# EAGLE schematic Z80_Sound_2 (EAGLE 5.10)
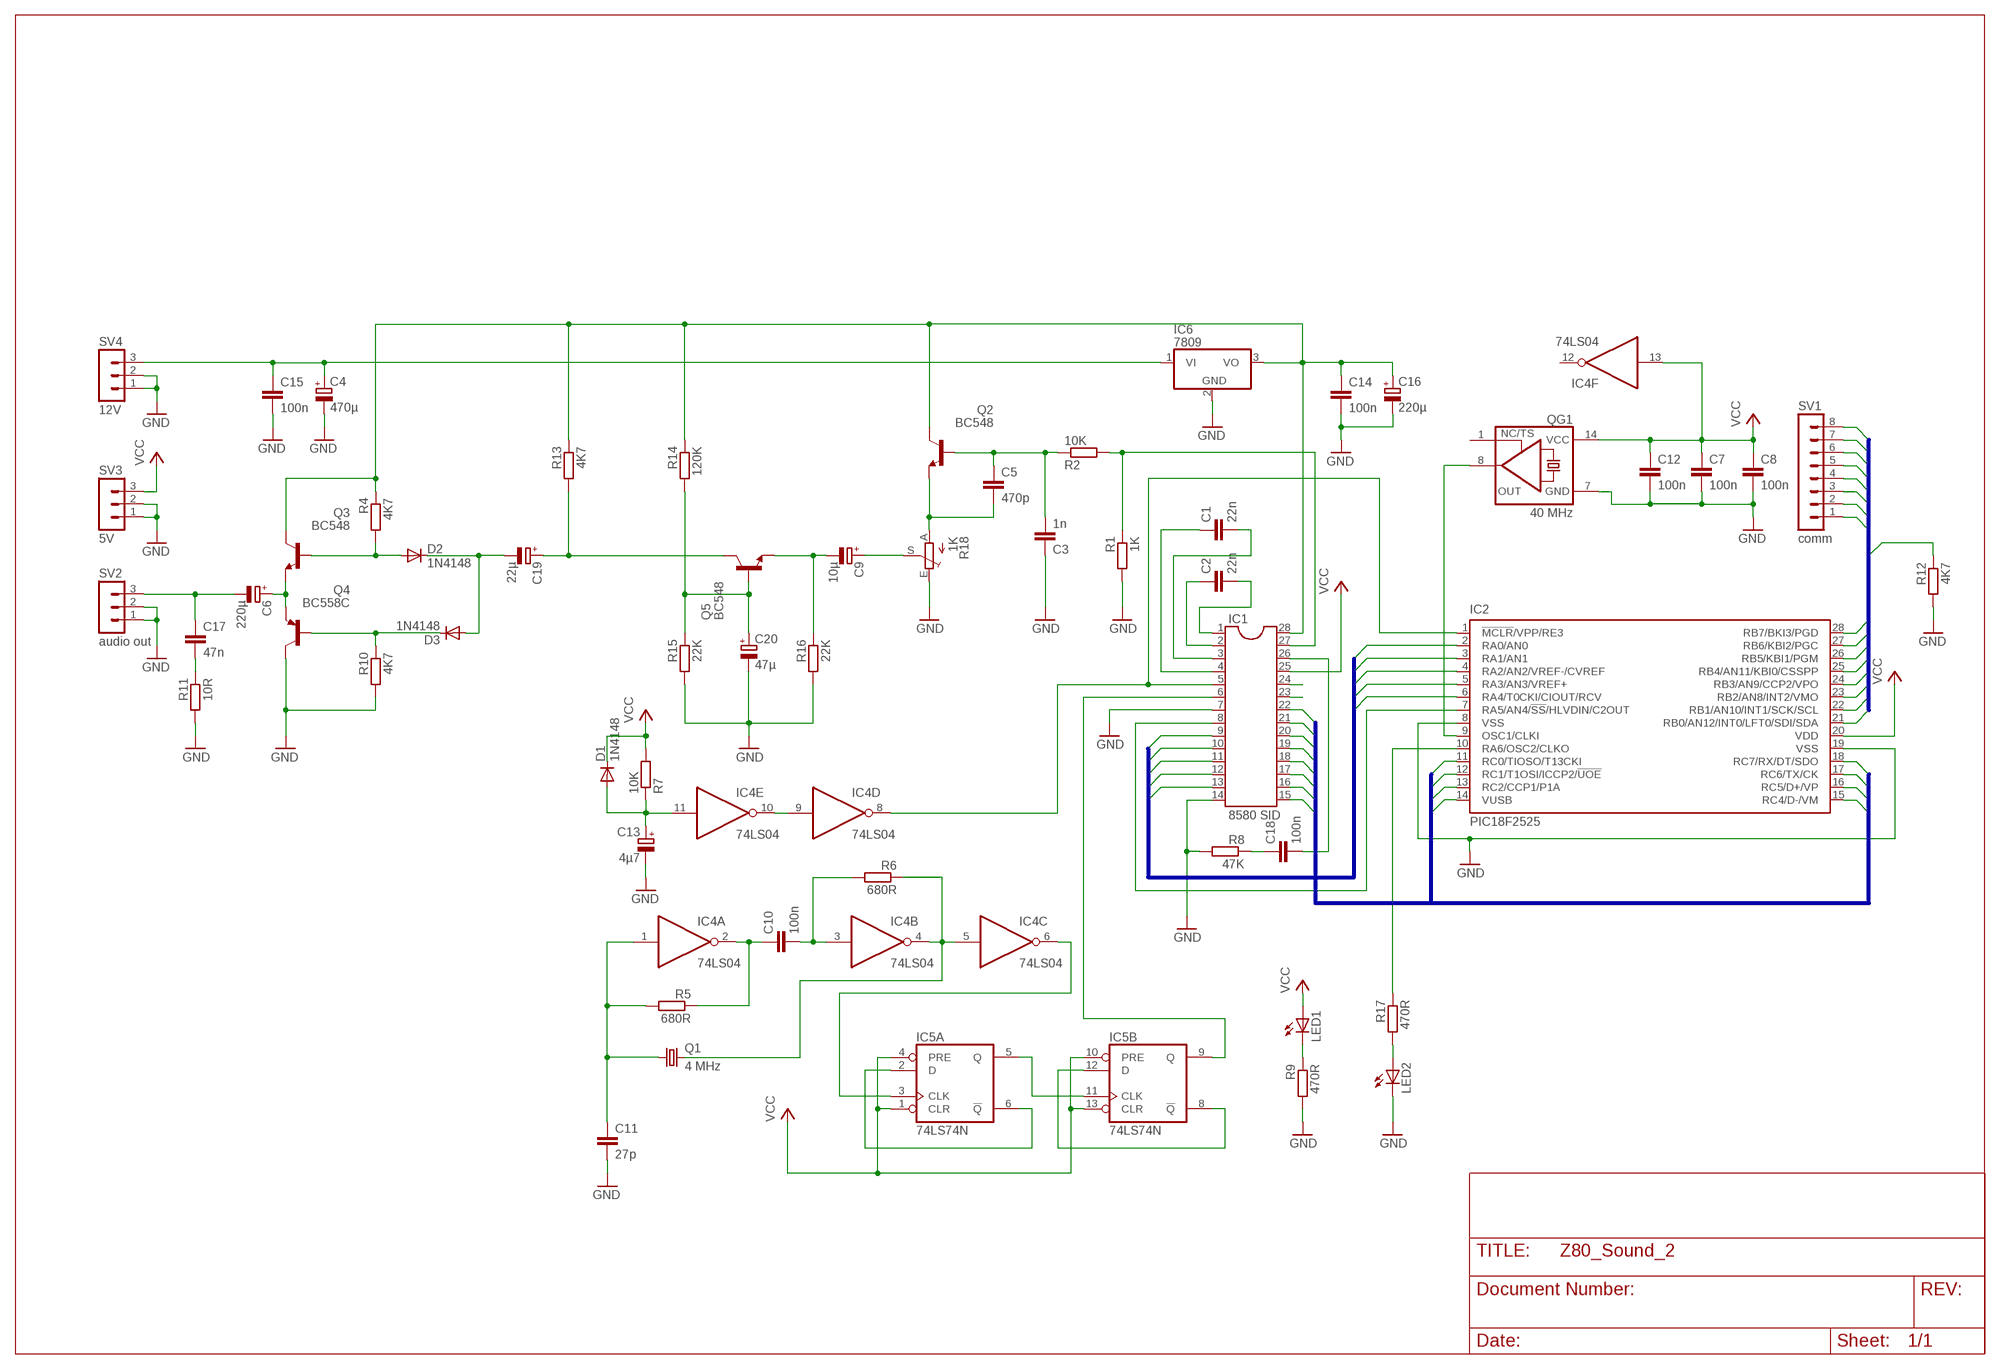
[diagram p0: schematic, sheet 1]

## Parts
C1  22n  C-EU050-035X075  [C050-035X075]
C2  22n  C-EU050-035X075  [C050-035X075]
C3  1n  C-EU050-035X075  [C050-035X075]
C4  470µ  CPOL-EUE3.5-10  [E3,5-10]
C5  470p  C-EU025-024X044  [C025-024X044]
C6  220µ  CPOL-EUE3.5-8  [E3,5-8]
C7  100n  C-EU050-030X075  [C050-030X075]
C8  100n  C-EU050-030X075  [C050-030X075]
C9  10µ  CPOL-EUE3.5-8  [E3,5-8]
C10  100n  C-EU050-030X075  [C050-030X075]
C11  27p  C-EU025-024X044  [C025-024X044]
C12  100n  C-EU050-030X075  [C050-030X075]
C13  4µ7  CPOL-EUE3.5-8  [E3,5-8]
C14  100n  C-EU050-030X075  [C050-030X075]
C15  100n  C-EU050-030X075  [C050-030X075]
C16  220µ  CPOL-EUE3.5-8  [E3,5-8]
C17  47n  C-EU050-024X044  [C050-024X044]
C18  100n  C-EU050-030X075  [C050-030X075]
C19  22µ  CPOL-EUE3.5-8  [E3,5-8]
C20  47µ  CPOL-EUE3.5-8  [E3,5-8]
D1  1N4148  1N4148DO35-7  [DO35-7]
D2  1N4148  1N4148DO35-7  [DO35-7]
D3  1N4148  1N4148DO35-7  [DO35-7]
IC1  8580 SID  DIL28  [DIL28-6]
IC2  PIC18F2525  PIC18F2455_28DIP  [DIL28-3]
IC4  74LS04  74LS04N  [DIL14]
IC5  74LS74N  [DIL14]
IC6  7809  786TV  [TO220V]
LED1  LED5MM  [LED5MM]
LED2  LED5MM  [LED5MM]
Q1  4 MHz  CRYSTALHC49S  [HC49/S]
Q2  BC548  [TO92-EBC]
Q3  BC548  [TO92-EBC]
Q4  BC558C  [TO92-EBC]
Q5  BC548  [TO92-EBC]
QG1  40 MHz  XO-14  [DIL14S]
R1  1K  R-EU_0207/10  [0207/10]
R2  10K  R-EU_0207/10  [0207/10]
R4  4K7  R-EU_0207/10  [0207/10]
R5  680R  R-EU_0207/10  [0207/10]
R6  680R  R-EU_0207/10  [0207/10]
R7  10K  R-EU_0207/10  [0207/10]
R8  47K  R-EU_0207/10  [0207/10]
R9  470R  R-EU_0207/10  [0207/10]
R10  4K7  R-EU_0207/10  [0207/10]
R11  10R  R-EU_0207/10  [0207/10]
R12  4K7  R-EU_0207/10  [0207/10]
R13  4K7  R-EU_0207/10  [0207/10]
R14  120K  R-EU_0207/10  [0207/10]
R15  22K  R-EU_0207/10  [0207/10]
R16  22K  R-EU_0207/2V  [0207/2V]
R17  470R  R-EU_0207/10  [0207/10]
R18  1K  TRIM_EU-LI15  [LI15]
SV1  comm  MA08-1  [MA08-1]
SV2  audio out  MA03-1  [MA03-1]
SV3  5V  MA03-1  [MA03-1]
SV4  12V  MA03-1  [MA03-1]

## Nets
+12V: C4.+ C15.1 IC6.1(VI) SV4.3
/CS: IC1.8 IC2.7(RA5/AN4/!SS!/HLVDIN/C2OUT)
/RES: IC1.5 IC2.1(!MCLR!/VPP/RE3) IC4.8(D:O)
A0: IC1.9 IC2.2(RA0/AN0)
A1: IC1.10 IC2.3(RA1/AN1)
A2: IC1.11 IC2.4(RA2/AN2/VREF-/CVREF)
A3: IC1.12 IC2.5(RA3/AN3/VREF+)
A4: IC1.13 IC2.6(RA4/T0CKI/CIOUT/RCV)
AUDIO_OUT: IC1.27 R1.1 R2.2
CAP1A: C2.2 IC1.1
CAP1B: C2.1 IC1.2
CAP2A: C1.2 IC1.3
CAP2B: C1.1 IC1.4
CLK_1MHZ: IC1.6 IC5.9(B:Q)
D0: IC1.15 IC2.11(RC0/TIOSO/T13CKI)
D1: IC1.16 IC2.12(RC1/T1OSI/ICCP2/!UOE)
D2: IC1.17 IC2.13(RC2/CCP1/P1A)
D3: IC1.18 IC2.14(VUSB)
D4: IC1.19 IC2.15(RC4/D-/VM)
D5: IC1.20 IC2.16(RC5/D+/VP)
D6: IC1.21 IC2.17(RC6/TX/CK)
D7: IC1.22 IC2.18(RC7/RX/DT/SDO)
GND: C3.1 C4.- C7.2 C8.2 C11.2 C12.2 C13.- C14.2 C15.2 C16.- C20.- IC1.7 IC1.14 IC2.8(VSS) IC2.19(VSS) IC6.2(GND) LED2.K(C) Q4.C QG1.7(GND) R1.2 R8.2 R9.2 R10.2 R11.2 R12.2 R15.2 R16.2 R18.E SV2.1 SV2.2 SV3.1 SV3.2 SV4.1 SV4.2
N$1: IC2.9(OSC1/CLKI) QG1.8(OUT)
N$2: IC4.4(B:O) IC4.5(C:I) Q1.2 R6.1
N$3: C5.2 Q2.E R18.A
N$4: LED1.K(C) R9.1
N$5: C6.- C17.1 SV2.3
N$6: C3.2 C5.1 Q2.B R2.1
N$7: LED2.A R17.2
N$8: C17.2 R11.1
N$9: D3.C Q4.B R10.1
N$10: D2.A Q3.B R4.2
N$11: C11.1 IC4.1(A:I) Q1.1 R5.2
N$12: IC5.2(A:D) IC5.6(A:!Q)
N$13: IC5.8(B:!Q) IC5.12(B:D)
N$14: IC4.6(C:O) IC5.3(A:CLK)
N$15: IC5.5(A:Q) IC5.11(B:CLK)
N$16: IC4.9(D:I) IC4.10(E:O)
N$17: C13.+ D1.A IC4.11(E:I) R7.1
N$18: C10.1 IC4.2(A:O) R5.1
N$19: C10.2 IC4.3(B:I) R6.2
N$20: C18.2 IC1.26
N$21: C6.+ Q3.E Q4.E
N$22: C19.- D2.C D3.A
N$23: C18.1 R8.1
N$24: IC2.10(RA6/OSC2/CLKO) R17.1
N$25: C19.+ Q5.C R13.2
N$26: C9.- Q5.E R16.1
N$27: C20.+ Q5.B R14.2 R15.1
N$30: C9.+ R18.S
POTX: IC1.24
POTY: IC1.23
RB0: IC2.21(RB0/AN12/INT0/LFT0/SDI/SDA) SV1.1
RB1: IC2.22(RB1/AN10/INT1/SCK/SCL) SV1.2
RB2: IC2.23(RB2/AN8/INT2/VMO) SV1.3
RB3: IC2.24(RB3/AN9/CCP2/VPO) SV1.4
RB4: IC2.25(RB4/AN11/KBI0/CSSPP) SV1.5
RB5: IC2.26(RB5/KBI1/PGM) SV1.6
RB6: IC2.27(RB6/KBI2/PGC) SV1.7
RB7: IC2.28(RB7/BKI3/PGD) R12.1 SV1.8
VCC: C7.1 C8.1 C12.1 D1.C IC1.25 IC2.20(VDD) IC4.13(F:I) IC5.1(A:CLR) IC5.4(A:PRE) IC5.10(B:PRE) IC5.13(B:CLR) LED1.A QG1.14(VCC) R7.2 SV3.3
VDD: C14.1 C16.+ IC1.28 IC6.3(VO) Q2.C Q3.C R4.1 R13.1 R14.1
Unconnected: IC4.12(F:O) QG1.1(TS)

## Buses
D[0..7]
RB[0..7]
A[0..4]

## Power pins joined to a net without a drawn wire
GND: IC4.7(P:GND) IC5.7(P:GND)
VCC: IC4.14(P:VCC) IC5.14(P:VCC)

## Library data of the parts
C1-C3 C5 C7 C8 C10-C12 C14 C15 C17 C18 = rcl:C-EU: CAPACITOR, European symbol
C4 C6 C9 C13 C16 C19 C20 = rcl:CPOL-EU: POLARIZED CAPACITOR, European symbol
D1-D3 = diode:1N4148: DIODE high speed (Philips)
IC1 = ic-package:DIL28: Dual In Line
IC2 = microchip:PIC18F2*_28: USB Microcontrollers with nanoWatt Technology High-Performance, Enhanced Flash, 28/40/44-Pin, Source: http://ww1.microchip.com/downloads/en/devicedoc/39632c.pdf
IC4 = 74xx-us:74*04: Hex INVERTER
IC5 = 74xx-us:74*74: Dual D type positive edge triggered FLIP FLOP, preset and clear
IC6 = linear:78*: Positive VOLTAGE REGULATOR Source: http://cache.national.com/ds/LM/LM78L05.pdf http://www.fairchildsemi.com/ds/LM/LM7805.pdf
LED1 LED2 = led:LED: LED OSRAM: - CHIPLED LG R971, LG N971, LY N971, LG Q971, LY Q971, LO R971, LY R971 LH N974, LH R974 LS Q976, LO Q976, LY Q976 LO Q996 - Hyper CHIPLED LW Q18S LB Q993, LB Q99A, LB R99A - SideLED LS A670, LO A670, LY A670, LG A670, LP A670 LB A673, LV A673, LT A673, LW A673 LH A674 LY A675 LS A676, LA A676, LO A676, LY A676, LW A676 LS A679, LY A679, LG A679 - Hyper Micro SIDELED® LS Y876, LA Y876, LO Y876, LY Y876 LT Y87S - SmartLED LW L88C, LW L88S LB L89C, LB L89S, LG L890 LS L89K, LO L89K, LY L89K LS L896, LA L896, LO L896, LY L896 - TOPLED LS T670, LO T670, LY T670, LG T670, LP T670 LSG T670, LSP T670, LSY T670, LOP T670, LYG T670 LG T671, LOG T671, LSG T671 LB T673, LV T673, LT T673, LW T673 LH T674 LS T676, LA T676, LO T676, LY T676, LB T676, LH T676, LSB T676, LW T676 LB T67C, LV T67C, LT T67C, LS T67K, LO T67K, LY T67K, LW E67C LS E67B, LA E67B, LO E67B, LY E67B, LB E67C, LV E67C, LT E67C LW T67C LS T679, LY T679, LG T679 LS T770, LO T770, LY T770, LG T770, LP T770 LB T773, LV T773, LT T773, LW T773 LH T774 LS E675, LA E675, LY E675, LS T675 LS T776, LA T776, LO T776, LY T776, LB T776 LHGB T686 LT T68C, LB T68C - Hyper Mini TOPLED® LB M676 - Mini TOPLED Santana® LG M470 LS M47K, LO M47K, LY M47K Source: http://www.osram.convergy.de LUXEON: - LUMILED® LXK2-PW12-R00, LXK2-PW12-S00, LXK2-PW14-U00, LXK2-PW14-V00 LXK2-PM12-R00, LXK2-PM12-S00, LXK2-PM14-U00 LXK2-PE12-Q00, LXK2-PE12-R00, LXK2-PE12-S00, LXK2-PE14-T00, LXK2-PE14-U00 LXK2-PB12-K00, LXK2-PB12-L00, LXK2-PB12-M00, LXK2-PB14-N00, LXK2-PB14-P00, LXK2-PB14-Q00 LXK2-PR12-L00, LXK2-PR12-M00, LXK2-PR14-Q00, LXK2-PR14-R00 LXK2-PD12-Q00, LXK2-PD12-R00, LXK2-PD12-S00 LXK2-PH12-R00, LXK2-PH12-S00 LXK2-PL12-P00, LXK2-PL12-Q00, LXK2-PL12-R00 Source: www.luxeon.com KINGBRIGHT: KA-3528ASYC Source: www.kingbright.com
Q1 = crystal:CRYSTAL: CRYSTAL
Q2 Q3 Q5 = transistor-npn:BC548*: NPN Transistor
Q4 = transistor-pnp:BC558*: PNP Transistror
QG1 = crystal:XO-: CRYSTAL
R1 R2 R4-R17 = rcl:R-EU_: RESISTOR, European symbol
R18 = pot:TRIM_EU-: POTENTIOMETER
SV1 = con-lstb:MA08-1: PIN HEADER
SV2-SV4 = con-lstb:MA03-1: PIN HEADER